# Altium project PCB_tp1.PrjPcb
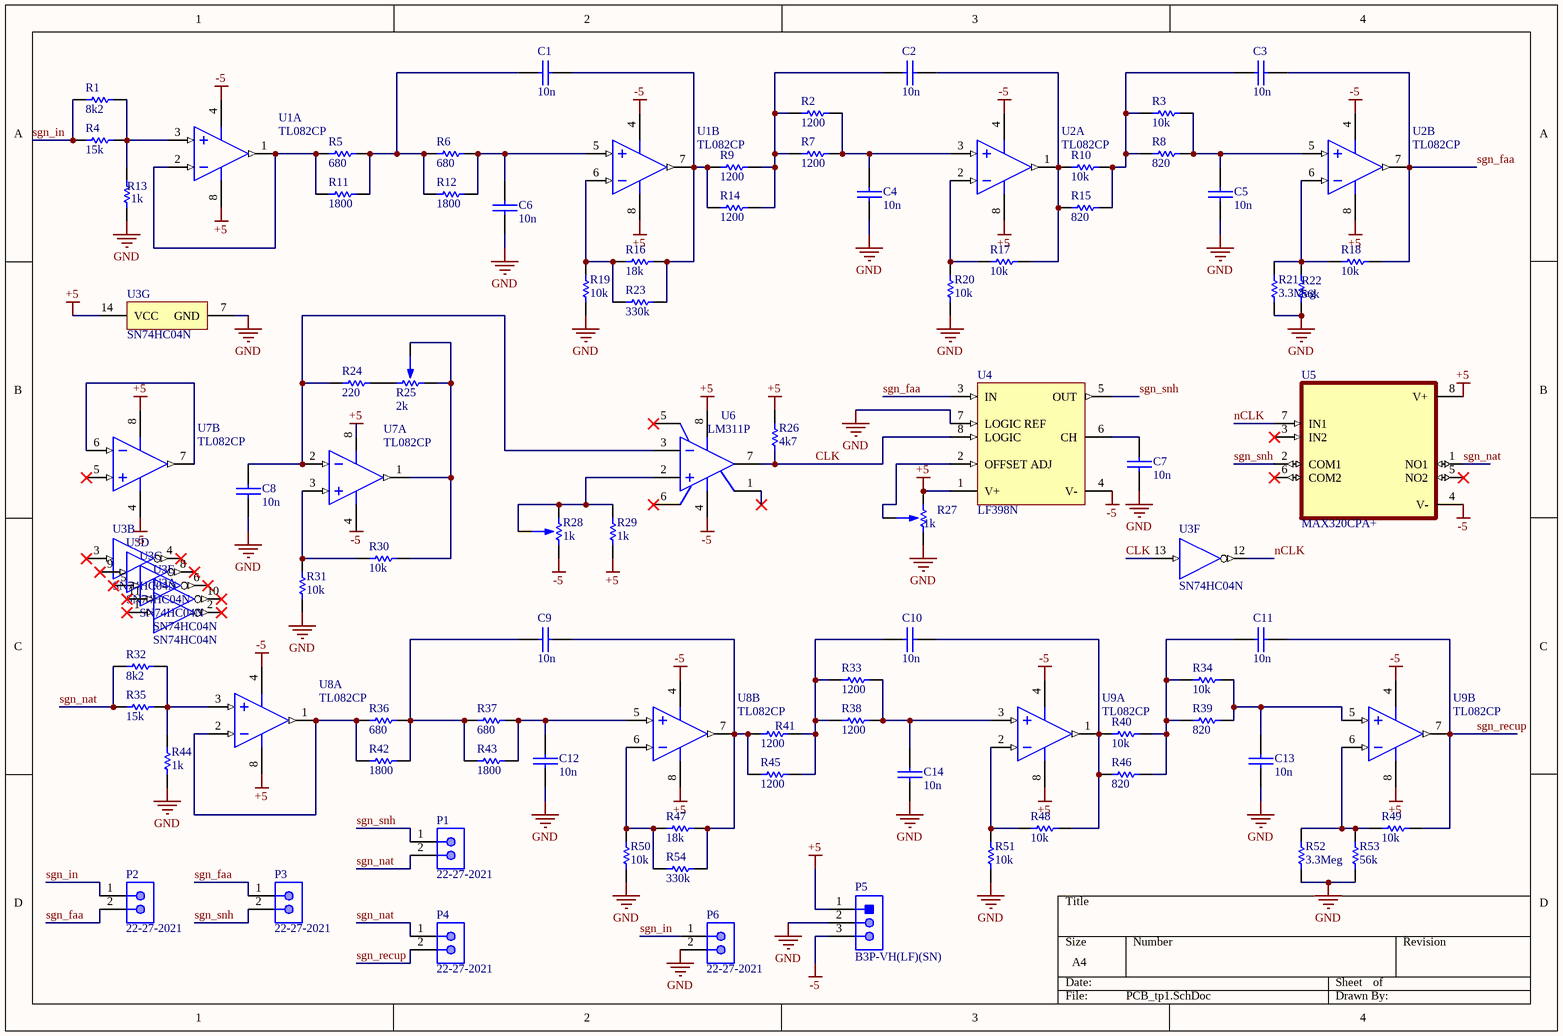
[diagram p0: PCB_tp1.SchDoc]
1 sheet, 83 parts. Net scope: global (net labels, ports and power ports of the same name join across sheets).
Board file: PCB_tp1.PcbDoc

## Sheet PCB_tp1.SchDoc
size A4; SheetNumber: 1; SheetTotal: 1

### Parts
C1  10n  [CAP200]
C2  10n  [CAP200]
C3  10n  [CAP200]
C4  10n  [CAP200]
C5  10n  [CAP200]
C6  10n  [CAP200]
C7  10n  [CAP200]
C8  10n  [CAP200]
C9  10n  [CAP200]
C10  10n  [CAP200]
C11  10n  [CAP200]
C12  10n  [CAP200]
C13  10n  [CAP200]
C14  10n  [CAP200]
P1  22-27-2021  [MOLX-22-27-2021_V]
P2  22-27-2021  [MOLX-22-27-2021_V]
P3  22-27-2021  [MOLX-22-27-2021_V]
P4  22-27-2021  [MOLX-22-27-2021_V]
P5  B3P-VH(LF)(SN)  [JST-B3P-VH(LF)(SN)-3_V]
P6  22-27-2021  [MOLX-22-27-2021_V]
R1  8k2  [RES400]
R2  1200  [RES400]
R3  10k  [RES400]
R4  15k  [RES400]
R5  680  [RES400]
R6  680  [RES400]
R7  1200  [RES400]
R8  820  [RES400]
R9  1200  [RES400]
R10  10k  [RES400]
R11  1800  [RES400]
R12  1800  [RES400]
R13  1k  [RES400]
R14  1200  [RES400]
R15  820  [RES400]
R16  18k  [RES400]
R17  10k  [RES400]
R18  10k  [RES400]
R19  10k  [RES400]
R20  10k  [RES400]
R21  3.3Meg  [RES400]
R22  56k  [RES400]
R23  330k  [RES400]
R24  220  [RES400]
R25  2k  [POTENCIOMETRO]
R26  4k7  [RES400]
R27  1k  [PRESET H]
R28  1k  [POTENCIOMETRO]
R29  1k  [RES400]
R30  10k  [RES400]
R31  10k  [RES400]
R32  8k2  [RES400]
R33  1200  [RES400]
R34  10k  [RES400]
R35  15k  [RES400]
R36  680  [RES400]
R37  680  [RES400]
R38  1200  [RES400]
R39  820  [RES400]
R40  10k  [RES400]
R41  1200  [RES400]
R42  1800  [RES400]
R43  1800  [RES400]
R44  1k  [RES400]
R45  1200  [RES400]
R46  820  [RES400]
R47  18k  [RES400]
R48  10k  [RES400]
R49  10k  [RES400]
R50  10k  [RES400]
R51  10k  [RES400]
R52  3.3Meg  [RES400]
R53  56k  [RES400]
R54  330k  [RES400]
U1  TL082CP  [P0008A]  (parts A,B of 2)
U2  TL082CP  [P0008A]  (parts A,B of 2)
U3  SN74HC04N  [N0014A]  (parts A,B,C,D,E,F,G of 7)
U4  LF398N  [N08E]
U5  MAX320CPA+  [DIP794W47P254L991H457Q8]
U6  LM311P  [FP-P0008A-MFG]
U7  TL082CP  [P0008A]  (parts A,B of 2)
U8  TL082CP  [P0008A]  (parts A,B of 2)
U9  TL082CP  [P0008A]  (parts A,B of 2)

### Nets
+5: P5.1 R26.1 R27.3 R29.2 U1.8(VCC+) U2.8(VCC+) U3.14(VCC) U4.1(V+) U5.8(V+) U6.8(VCC+) U7.8(VCC+) U8.8(VCC+) U9.8(VCC+)
-5: P5.3 R28.1 U1.4(VCC-) U2.4(VCC-) U4.4(V-) U5.4(V-) U6.4(VCC-) U7.4(VCC-) U8.4(VCC-) U9.4(VCC-)
GND: C4.1 C5.2 C6.2 C7.2 C8.2 C12.2 C13.2 C14.1 P5.2 P6.2 R13.1 R19.2 R20.1 R21.2 R22.2 R27.1 R31.1 R44.1 R50.2 R51.1 R52.2 R53.2 U3.7(GND) U4.7(LOGIC_REF)
CLK: R26.2 U3.13(6A) U4.8(LOGIC) U6.7(COL_OUT)
nCLK: U3.12(~{6Y}) U5.7(IN1)
sgn_faa: C3.2 P2.2 P3.1 R18.2 U2.7(OUT2) U4.3(IN)
sgn_in: P2.1 P6.1 R1.1 R4.1
sgn_nat: P1.2 P4.1 R32.1 R35.1 U5.1(NO1)
sgn_recup: C11.2 P4.2 R49.2 U9.7(OUT2)
sgn_snh: P1.1 P3.2 U4.5(OUT) U5.2(COM1)
NetC1_1: C1.1 R5.1 R6.2 R11.1 R12.2
NetC1_2: C1.2 R9.1 R14.1 R16.1 R23.1 U1.7(OUT2)
NetC2_1: C2.1 R10.2 R15.2 R17.1 U2.1(OUT1)
NetC2_2: C2.2 R2.1 R7.1 R9.2 R14.2
NetC3_1: C3.1 R3.2 R8.2 R10.1 R15.1
NetC4_2: C4.2 R2.2 R7.2 U2.3(IN1+)
NetC5_1: C5.1 R3.1 R8.1 U2.5(IN2+)
NetC6_1: C6.1 R6.1 R12.1 U1.5(IN2+)
NetC7_1: C7.1 U4.6(CH)
NetC8_1: C8.1 R24.2 U6.3(IN-) U7.2(IN1-)
NetC9_1: C9.1 R36.1 R37.2 R42.1 R43.2
NetC9_2: C9.2 R41.1 R45.1 R47.2 R54.2 U8.7(OUT2)
NetC10_1: C10.1 R40.2 R46.2 R48.1 U9.1(OUT1)
NetC10_2: C10.2 R33.1 R38.1 R41.2 R45.2
NetC11_1: C11.1 R34.2 R39.2 R40.1 R46.1
NetC12_1: C12.1 R37.1 R43.1 U8.5(IN2+)
NetC13_1: C13.1 R34.1 R39.1 U9.5(IN2+)
NetC14_2: C14.2 R33.2 R38.2 U9.3(IN1+)
NetR1_2: R1.2 R4.2 R13.2 U1.3(IN1+)
NetR5_2: R5.2 R11.2 U1.1(OUT1) U1.2(IN1-)
NetR16_2: R16.2 R19.1 R23.2 U1.6(IN2-)
NetR17_2: R17.2 R20.2 U2.2(IN1-)
NetR18_1: R18.1 R21.1 R22.1 U2.6(IN2-)
NetR24_1: R24.1 R25.1
NetR25_2: R25.2 R25.3 R30.2 U7.1(OUT1)
NetR27_2: R27.2 U4.2(OFFSET_ADJ)
NetR28_2: R28.2 R28.3 R29.1 U6.2(IN+)
NetR30_1: R30.1 R31.2 U7.3(IN1+)
NetR32_2: R32.2 R35.2 R44.2 U8.3(IN1+)
NetR36_2: R36.2 R42.2 U8.1(OUT1) U8.2(IN1-)
NetR47_1: R47.1 R50.1 R54.1 U8.6(IN2-)
NetR48_2: R48.2 R51.2 U9.2(IN1-)
NetR49_1: R49.1 R52.1 R53.1 U9.6(IN2-)
NetU7_6: U7.6(IN2-) U7.7(OUT2)

Not connected (* = marked no-connect by the designer): U3 1(1A)* 2(~{1Y})* 3(2A)* 4(~{2Y})* 5(3A)* 6(~{3Y})* 8(~{4Y})* 9(4A)* 10(~{5Y})* 11(5A)*; U5 3(IN2)* 5(NO2)* 6(COM2)*; U6 1(EMIT_OUT)* 5(BALANCE)* 6(BAL/STRB)*; U7 5(IN2+)*

### Library data of the parts
C1-C14 = CAP
P1-P4 P6 = CMP-2000-05537-1: Male Header, Pitch 2.54 mm, 1 x 2 Position, Height 11.7 mm, Tail Length 3.56 mm, 0 to 75 degC, RoHS, Bulk; Manufacturer: Molex; PartNumber: 0022272021; Current rating: 4A; Package Version: Rev. BC, 02/2012; Voltage rating: 250V; No. of Positions: 2; Pitch: 2.54mm; No. of Rows: 1; Orientation: Vertical; Operating temperature: 0°Cto+75°C; Manufacturer URL: http://www.molex.com/; Mounting Technology: ThroughHole; Housing material: Nylon(UL94V-0); Package Description: 2-Leads Header, Body 5.08 x 5.8 mm, Pitch 2.54 mm; Voltage - Max: 250V; Datasheet URL: http://www.molex.com/pdm_docs/sd/022272021_sd.pdf; Package Reference: 22-27-2021; Contact material: Tinplatedbrass; Current - Max: 4A; Datasheet Version: Rev. F, 06/2009
P5 = CMP-1755-00003-1: Male Header, Pitch 3.96 mm, 1 x 3 Position, Height 10.9 mm, Tail Length 3.7 mm, -25 to 85 degC, RoHS, Bulk; PackageReference: B3P-VH(LF)(SN); ComponentLink2Description: Datasheet; ComponentLink2URL: http://www.jst-mfg.com/product/pdf/eng/eVH.pdf; DatasheetVersion: May-16; PackageDescription: Male Header, Pitch 3.96 mm, 1 x 3 Position, Height 10.9 mm, Tail Length 3.7 mm; ComponentLink1URL: http://www.jst.com/home2.html; ComponentLink1Description: Manufacturer URL
R1-R24 R26 R29-R54 = RES
R25 R28 = POTENCIOMETRO
R27 = PRESET
U1 U2 U7-U9 = CMP-0055-00158-5: JFET-Input Operational Amplifier, 7 to 36 V, 0 to 70 degC, 8-pin DIP (P8), Pb-Free (RoHS); Manufacturer: Texas Instruments; Total Supply Voltage(Max)(+5V is 5, +/-5V is 10): 36; Rating: Catalog; Number of Channels: 2; Slew Rate(Typ)(V/us): 13; CMRR(Min)(dB): 70; Sub Family: General Purpose Amplifier, High Supply Voltage Amplifier (>=30V); Offset Drift(Typ)(uV/C): 18; Total Supply Voltage(Min)(+5V is 5, +/-5V is 10): 7; IIB(Max)(pA): 400; GBW(Typ)(MHz): 3; Iq per channel(Max)(mA): 2.8; Vio (25C)(Max)(mV): 15; PackageDescription: 8-Pin Plastic In-Line, Body 9.59 x 6.35 mm, Pitch 2.54 mm; ComponentLink2URL: http://www.ti.com/lit/ds/symlink/tl082.pdf; Mounting Technology: Through Hole; Code_JEDEC: MS-001; ComponentLink1Description: Manufacturer URL; ComponentLink3Description: Package Specification; PartNumber: TL082CP; PackageVersion: 4040082/E, 04/2010; Eco-Plan: Pb-Free (RoHS); ComponentLink1URL: http://www.ti.com/; PackageReference: P0008A; ComponentLink3URL: http://www.ti.com/litv/pdf/mpdi001b; DatasheetVersion: SLOS081G; ComponentLink2Description: Datasheet; Vn at 1kHz(Typ)(nV/rtHz): 18
U3 = CMP-1615-00892-2: Hex Inverters, N0014A, TUBE; Manufacturer: Texas Instruments; VCC(Min)(V): 2; Bits(#): 6; Technology Family: HC; tpd @ Nom Voltage(Max)(ns): 20; Output Drive (IOL/IOH)(Max)(mA): -4/4; Rating: Catalog; Voltage(Nom)(V): 5; Schmitt Trigger: No; ICC @ Nom Voltage(Max)(mA): 0.02; Input Type: CMOS; Code_JEDEC: MS-001; PackageReference: N0014A; DatasheetVersion: SCLS078F; Output Type: CMOS; VCC(Max)(V): 6; Operating Temperature Range(C): -40 to 85; Generic Part Number: SN74HC04; F @ Nom Voltage(Max)(Mhz): 20
U4 = CMP-0056-00013-2: Monolithic Sample and Hold Circuits, 8-pin MDIP; Manufacturer: National Semiconductor; PowerWise: N; PackageTopMarking: NSUZXYTTE#*LF*398N; CompType: Analog IC; PackageReference: N08E; PackageVersion: revG, May-2006; Code_JEDEC: MS-001-BA; ComponentLink1URL: http://www.national.com/ds/LF/LF398.pdf; DatasheetVersion: Jul-2000; RoHS: N; ComponentLink2URL: http://www.national.com/pf/LF/LF398.html; ComponentLink2Description: LF398 Web Page; ComponentLink3URL: http://www.national.com/packaging/folders/n08e.html; ComponentLink1Description: LF398 Datasheet; RevisionNote: Component URLs added; PinCount: 8; ComponentLink3Description: N08E Package Page; PackageDescription: MDIP, .365 x .250 x .130in, 8 Lead, .100in Pitch
U5 = MAX320CPA+: Precision, Dual Supply, SPST, Analog CMOS Switches; MF: Analog Devices; SnapEDA_Link: https://www.snapeda.com/parts/MAX320CPA+/Analog+Devices/view-part/?ref=snap; Package: PDIP-8 Maxim; Value: *; MP: MAX320CPA+; Check_prices: https://www.snapeda.com/parts/MAX320CPA+/Analog+Devices/view-part/?ref=eda
U6 = CMP-1685-00016-2: Manufacturer Lifecycle Status: ACTIVE; NexarPartId: 24336; Output Type: TTL; Max Output Voltage: 7.5mV; Min Supply Voltage: 3.5V; Min Dual Supply Voltage: 1.75V; Max Supply Current: 7.5mA; Number of Elements: 1; Response Time: 165ns; Max Dual Supply Voltage: 15V; Max Supply Voltage: 30V; Max Junction Temperature (Tj): 150°C; Max Power Dissipation: 500mW; Input Offset Voltage (Vos): 2mV; Resistance: 390Ω; Operating Supply Voltage: 28V; Power Rating: 100mW; Dual Supply Voltage: 9V; Output Current per Channel: 50mA; Turn-On Delay Time: 115ns; Tolerance: 1%; Voltage Gain: 106.02dB; Input Bias Current: 250nA; Voltage Rating: 75V; Contact Plating: Gold; Case Code (Imperial): 0603; Number of Circuits: 1; Lifecycle Status: Production; Ambient Temperature Range High: 70°C; Radiation Hardening: No; Quiescent Current: 7.5mA; Number of Channels: 1; Max Operating Temperature: 70°C; Height: 5.08mm; Type: General Purpose; Case Code (Metric): 1608; Mount: Surface Mount, Through Hole; Case/Package: PDIP; Thickness: 3.9mm; REACH SVHC: No SVHC; Length: 9.81mm; RoHS: Compliant; Schedule B: 8542390000, 8542390000; Lead Free: Lead Free; Min Operating Temperature: 0°C; Width: 6.35mm; Output Current: 50mA; Packaging: Tape and Reel; Nominal Supply Current: 7.5mA; Weight: 2.012816mg; Propagation Delay: 115ns; Max Input Current: 250nA; Number of Pins: 8